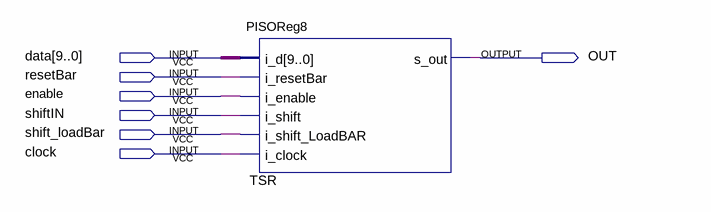
[diagram p0: schematic sheet]
// Quartus schematic testPISO.bdf as structural Verilog: 1 symbols, 7 pins
module testPISO (
  input  [9:0] data,
  input  resetBar,
  input  enable,
  input  shiftIN,
  input  shift_loadBar,
  input  clock,
  output OUT
);

  PISOReg8 TSR (
    .i_d(data), .i_resetBar(resetBar), .i_enable(enable), .i_shift(shiftIN), .i_shift_LoadBAR(shift_loadBar),
    .i_clock(clock), .s_out(OUT));
endmodule
